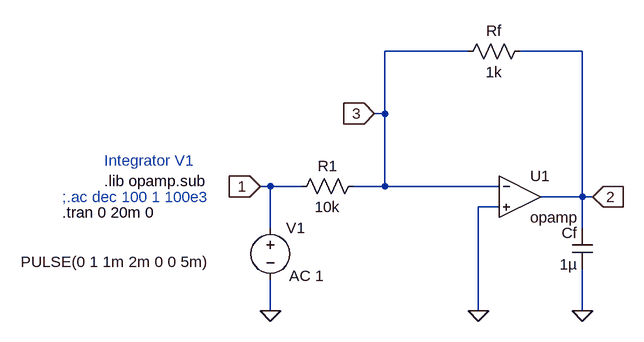
[diagram p0: schematic integrator_v3.asc]
integrator_v3.asc, the LTspice schematic file:
Version 4
SHEET 1 880 680
WIRE 288 -128 160 -128
WIRE 464 -128 368 -128
WIRE 160 -32 160 -128
WIRE 160 -32 144 -32
WIRE -16 80 -32 80
WIRE 32 80 -16 80
WIRE 160 80 160 -32
WIRE 160 80 112 80
WIRE 336 80 160 80
WIRE 464 96 464 -128
WIRE 464 96 400 96
WIRE 480 96 464 96
WIRE 336 112 304 112
WIRE -16 144 -16 80
WIRE 464 144 464 96
WIRE -16 272 -16 224
WIRE 304 272 304 112
WIRE 464 272 464 208
FLAG 304 272 0
FLAG -16 272 0
FLAG -32 80 1
IOPIN -32 80 In
FLAG 480 96 2
IOPIN 480 96 In
FLAG 144 -32 3
IOPIN 144 -32 In
FLAG 464 272 0
SYMBOL voltage -16 128 R0
WINDOW 123 29 90 Left 2
WINDOW 39 0 0 Left 0
WINDOW 3 -384 68 Left 2
SYMATTR Value2 AC 1
SYMATTR Value PULSE(0 1 1m 2m 0 0 5m)
SYMATTR InstName V1
SYMBOL OpAmps\\opamp 368 32 R0
SYMATTR InstName U1
SYMBOL res 128 64 R90
WINDOW 0 0 56 VBottom 2
WINDOW 3 32 56 VTop 2
SYMATTR InstName R1
SYMATTR Value 10k
SYMBOL res 272 -112 R270
WINDOW 0 32 56 VTop 2
WINDOW 3 0 56 VBottom 2
SYMATTR InstName Rf
SYMATTR Value 1k
SYMBOL cap 480 208 R180
WINDOW 0 24 56 Left 2
WINDOW 3 24 8 Left 2
SYMATTR InstName Cf
SYMATTR Value 1µ
TEXT -272 72 Left 2 !.lib opamp.sub
TEXT -336 96 Left 2 ;;.ac dec 100 1 100e3
TEXT -272 40 Left 2 ;Integrator V1
TEXT -336 120 Left 2 !.tran 0 20m 0

The netlist it stands for:
* integrator_v3.asc
V1 1 0 PULSE(0 1 1m 2m 0 0 5m) AC 1
XU1 3 0 2 opamp Aol=100K GBW=10Meg  ; pins invin noninvin out
R1 3 1 10k
Rf 3 2 1k
Cf 0 2 1µ
.lib opamp.sub
* ;.ac dec 100 1 100e3
* Integrator V1
.tran 0 20m 0
.backanno
.end